# EAGLE design wrt54g_extension_board (EAGLE 5.11)
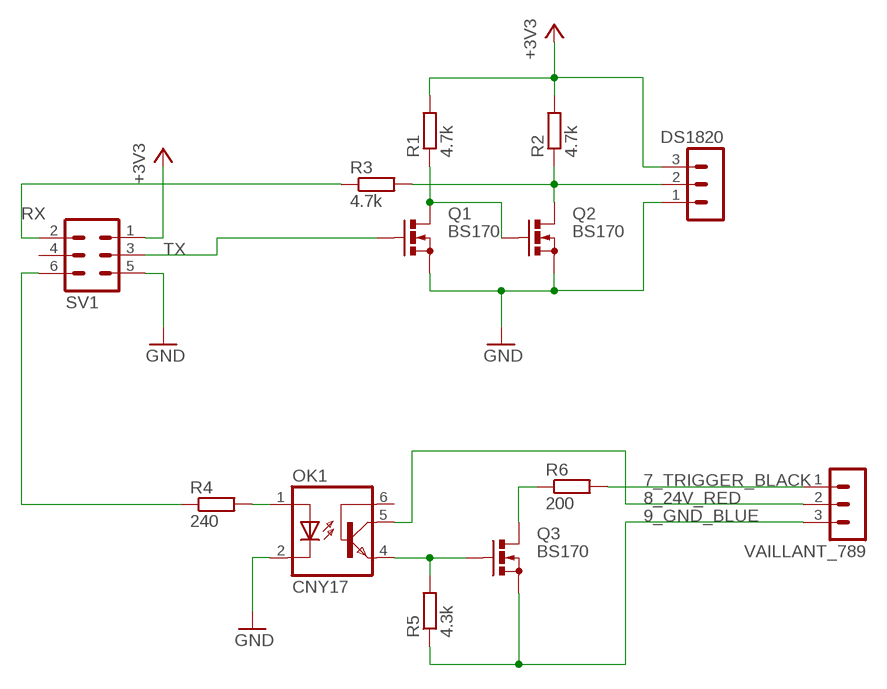
[diagram p0: schematic, sheet 1]

## Parts
DS1820  MA03-1  [MA03-1]
OK1  CNY17  [DIL06]
Q1  BS170  [SOT54E]
Q2  BS170  [SOT54E]
Q3  BS170  [SOT54E]
R1  4.7k  R-EU_0204/2V  [0204V]
R2  4.7k  R-EU_0204/2V  [0204V]
R3  4.7k  R-EU_0204/5  [0204/5]
R4  240  R-EU_0204/7  [0204/7]
R5  4.3k  R-EU_0204/2V  [0204V]
R6  200  R-EU_0204/7  [0204/7]
SV1  MA03-2  [MA03-2]
VAILLANT_789  MA03-1  [MA03-1]

## Nets
7_TRIGGER_BLACK: R6.2 VAILLANT_789.1
8_24V_RED: OK1.5(COL) VAILLANT_789.2
9_GND_BLUE: Q3.S R5.1 VAILLANT_789.3
+3V3: DS1820.3 R1.2 R2.2 SV1.1
GND: DS1820.1 OK1.2(C) Q1.S Q2.S SV1.5
GPIO7: R4.1 SV1.6
N$1: Q1.D Q2.G R1.1
N$2: DS1820.2 Q2.D R2.1 R3.2
N$3: OK1.1(A) R4.2
N$5: Q3.D R6.1
N$6: OK1.4(EMI) Q3.G R5.2
RX: R3.1 SV1.2
TX: Q1.G SV1.3
Unconnected: OK1.6(BAS) SV1.4

## Library data of the parts
DS1820 VAILLANT_789 = con-lstb:MA03-1: PIN HEADER; OC_FARNELL: unknown; OC_NEWARK: unknown
OK1 = optocoupler:CNY17: SIEMENS OPTO COUPLER; MPN: CNY17-1; OC_FARNELL: 1045399; OC_NEWARK: 05M4044
Q1-Q3 = transistor-small-signal:BS170: N-CHANNEL MOS FET
R1-R6 = resistor:R-EU_: RESISTOR, European symbol
SV1 = con-lstb:MA03-2: PIN HEADER; OC_FARNELL: unknown; OC_NEWARK: unknown

## Board
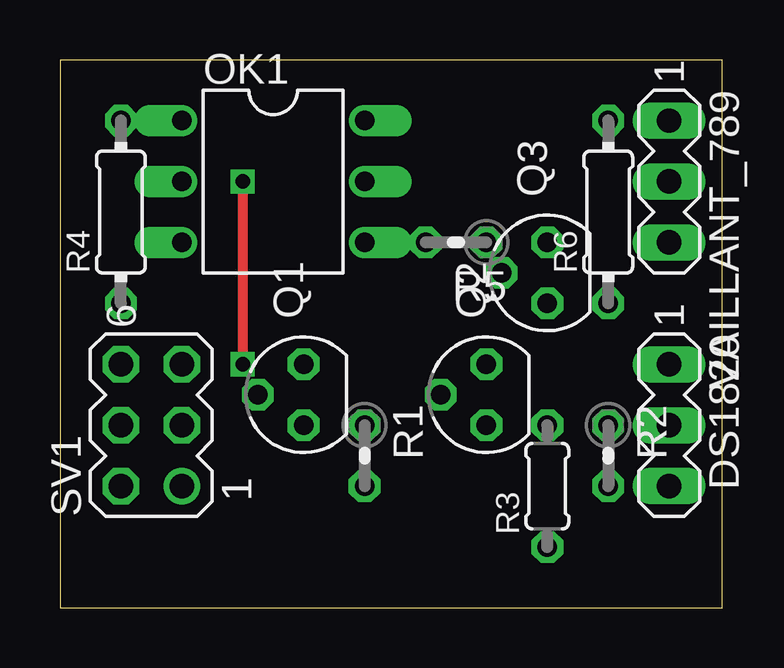
[diagram p1: board, top side]
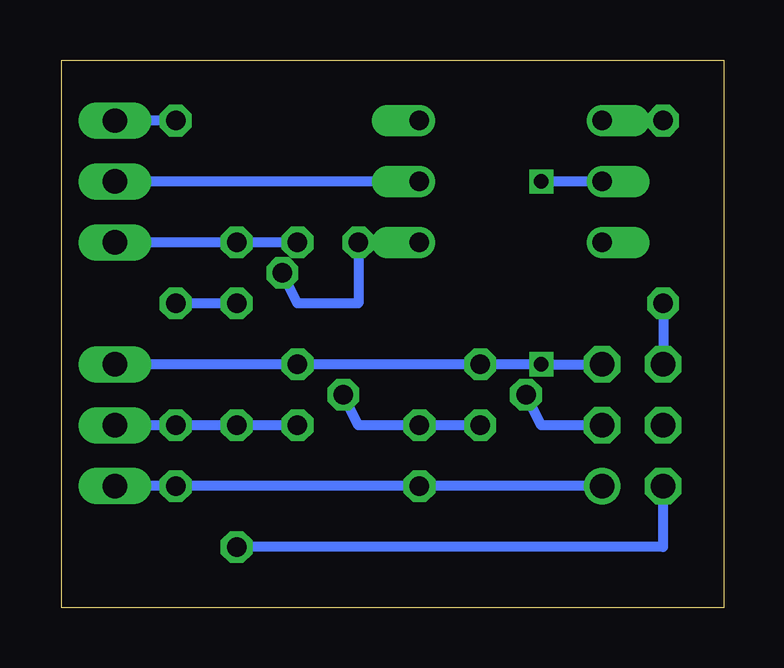
[diagram p2: board, bottom side, seen from below]

Size 27.61 x 22.85 mm. Coordinates in mm from the lower left corner, seen from the top.
Outline: 0,0 27.61,0 27.61,22.85 0,22.85 0,0
Copper layers (1*16): Top 0.035mm / dielectric 1.5mm / Bottom 0.035mm
Design rules "default": minimum track width 10mil, minimum drill 24mil, track to track 8mil, track to pad 8mil, pad to pad 8mil, via to via 8mil, smd to smd 8mil, copper to edge 40mil, drill to drill 8mil, minimum pad ring 10mil, minimum via ring 8mil, stop-mask expansion 4mil, vias tented up to drill 0mil, thermal gap 10mil

### Footprints (pad centres in the part's own frame; a part is rotated, then mirrored left to right if it is on the bottom)
MA03-1 = drill 1.016 long: 1 -2.54,0; 2 0,0; 3 2.54,0
DIL06 = drill 0.813 offset: 1 -2.54,-3.81; 2 0,-3.81; 3 2.54,-3.81; 4 2.54,3.81; 5 0,3.81; 6 -2.54,3.81
SOT54E = drill 0.813 octagon: D -1.27,0; G 0,1.905; S 1.27,0
0204V = drill 0.813 octagon: 1 -1.27,0; 2 1.27,0
0204/5 = drill 0.813 octagon: 1 -2.54,0; 2 2.54,0
0204/7 = drill 0.813 octagon: 1 -3.81,0; 2 3.81,0
MA03-2 = drill 1.016 round: 1 -2.54,-1.27 | drill 1.016 octagon: 2 -2.54,1.27; 3 0,-1.27; 4 0,1.27; 5 2.54,-1.27; 6 2.54,1.27

### Placement (x,y rotation side)
DS1820  25.4,7.62 270 top
OK1  8.89,17.78 270 top
Q1  10.16,8.89 90 top
Q2  17.78,8.89 90 top
Q3  20.32,13.97 90 top
R1  12.7,6.35 270 top
R2  22.86,6.35 270 top
R3  20.32,5.08 90 top
R4  2.54,16.51 90 top
R5  16.51,15.24 180 top
R6  22.86,16.51 90 top
SV1  3.81,7.62 90 top
VAILLANT_789  25.4,17.78 270 top

### Tracks (layer width: path | path; a pad name or v marks a point on that pad's centre or on a via)
7_TRIGGER_BLACK
  Bottom 0.406: R6.2 VAILLANT_789.1
8_24V_RED
  Bottom 0.406: OK1.5 VAILLANT_789.2
9_GND_BLUE
  Bottom 0.406: R5.1 Q3.S VAILLANT_789.3
+3V3
  Bottom 0.406: DS1820.3 R2.2 R1.2 SV1.1
GND  (via drill 0.6)
  Top 0.406: v7.62,17.78 v7.62,10.16
  Bottom 0.406: DS1820.1 Q2.S Q1.S v7.62,10.16 SV1.5 | OK1.2 v7.62,17.78
GPIO7
  Bottom 0.406: R4.1 SV1.6
N$1
  Bottom 0.406: Q2.G 15.24,7.62 R1.1 Q1.D
N$2
  Bottom 0.406: DS1820.2 R2.1 Q2.D R3.2
N$3
  Bottom 0.406: OK1.1 R4.2
N$5
  Bottom 0.406: Q3.D R6.1
N$6
  Bottom 0.406: OK1.4 R5.2 15.24,12.7 17.78,12.7 Q3.G
RX
  Bottom 0.406: R3.1 2.54,2.54 SV1.2
TX
  Bottom 0.406: SV1.3 7.62,7.62 Q1.G